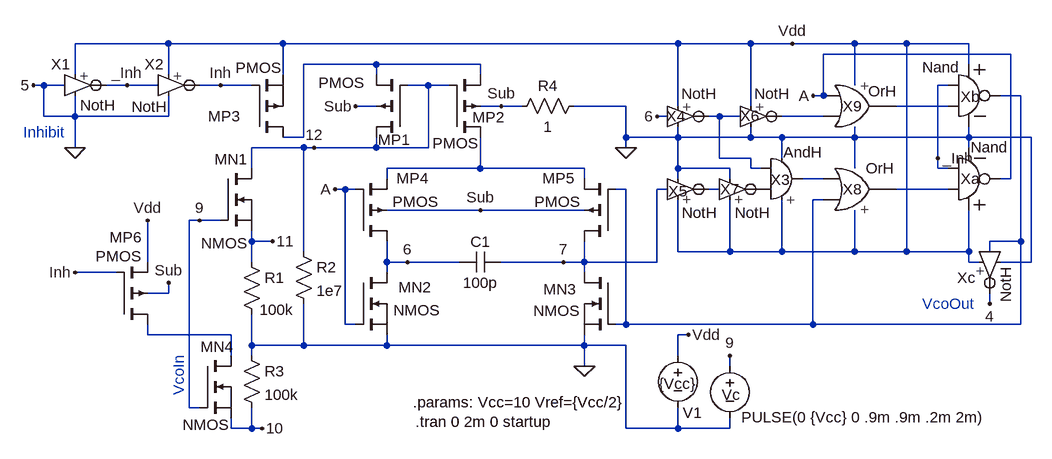
[diagram p0: schematic Ti46Vco.asc]
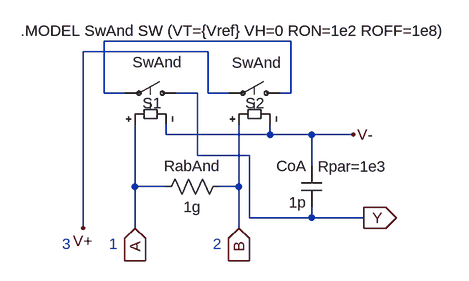
[diagram p1: sub-circuit andh.asc]
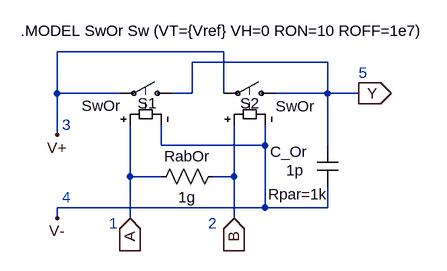
[diagram p2: sub-circuit orh.asc]
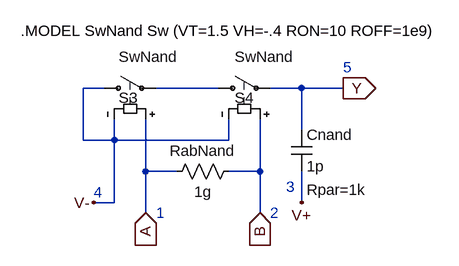
[diagram p3: sub-circuit nand.asc]
Ti46Vco.asc, the LTspice schematic file:
Version 4
SHEET 1 1204 1096
WIRE -384 112 -400 112
WIRE -384 160 -384 112
WIRE -352 112 -384 112
WIRE -336 96 -336 48
WIRE -336 160 -384 160
WIRE -336 160 -336 128
WIRE -336 208 -336 160
WIRE -272 400 -336 400
WIRE -256 112 -288 112
WIRE -224 384 -224 320
WIRE -224 496 -224 480
WIRE -208 112 -256 112
WIRE -192 48 -336 48
WIRE -192 96 -192 48
WIRE -192 160 -336 160
WIRE -192 160 -192 128
WIRE -192 432 -224 432
WIRE -192 432 -192 416
WIRE -160 608 -160 320
WIRE -144 320 -160 320
WIRE -144 608 -160 608
WIRE -112 112 -144 112
WIRE -112 320 -144 320
WIRE -96 496 -224 496
WIRE -96 528 -96 496
WIRE -96 640 -96 624
WIRE -64 112 -112 112
WIRE -64 240 -64 208
WIRE -64 352 -64 336
WIRE -64 384 -64 352
WIRE -64 512 -64 464
WIRE -64 528 -64 512
WIRE -64 640 -96 640
WIRE -64 640 -64 608
WIRE -48 640 -64 640
WIRE -32 352 -64 352
WIRE -16 48 -192 48
WIRE -16 96 -16 48
WIRE 16 192 -16 192
WIRE 16 192 16 80
WIRE 16 208 -64 208
WIRE 16 368 16 208
WIRE 16 512 -64 512
WIRE 16 512 16 448
WIRE 32 208 16 208
WIRE 80 272 64 272
WIRE 80 480 80 272
WIRE 96 272 80 272
WIRE 96 480 80 480
WIRE 128 80 16 80
WIRE 128 96 128 80
WIRE 128 144 96 144
WIRE 128 208 32 208
WIRE 128 208 128 192
WIRE 144 256 144 240
WIRE 144 384 144 352
WIRE 144 400 144 384
WIRE 144 512 16 512
WIRE 144 512 144 496
WIRE 176 384 144 384
WIRE 208 112 176 112
WIRE 208 208 128 208
WIRE 208 208 208 112
WIRE 240 112 208 112
WIRE 256 384 176 384
WIRE 288 80 128 80
WIRE 288 96 288 80
WIRE 288 240 144 240
WIRE 288 240 288 192
WIRE 288 304 144 304
WIRE 320 144 288 144
WIRE 352 144 320 144
WIRE 416 384 320 384
WIRE 448 240 288 240
WIRE 448 256 448 240
WIRE 448 304 288 304
WIRE 448 384 416 384
WIRE 448 384 448 352
WIRE 448 400 448 384
WIRE 448 512 144 512
WIRE 448 512 448 496
WIRE 448 544 448 512
WIRE 512 144 432 144
WIRE 512 192 512 144
WIRE 512 208 512 192
WIRE 512 272 496 272
WIRE 512 480 496 480
WIRE 512 480 512 272
WIRE 512 512 448 512
WIRE 512 640 512 512
WIRE 560 384 448 384
WIRE 560 384 560 272
WIRE 576 160 560 160
WIRE 576 272 560 272
WIRE 592 48 -16 48
WIRE 592 144 592 48
WIRE 592 192 512 192
WIRE 592 192 592 176
WIRE 592 240 592 192
WIRE 592 256 592 240
WIRE 592 368 592 288
WIRE 592 528 592 496
WIRE 592 640 512 640
WIRE 592 640 592 608
WIRE 608 496 592 496
WIRE 656 160 640 160
WIRE 656 224 656 160
WIRE 656 272 640 272
WIRE 672 240 592 240
WIRE 672 256 672 240
WIRE 672 368 592 368
WIRE 672 368 672 288
WIRE 672 544 672 528
WIRE 672 640 592 640
WIRE 672 640 672 624
WIRE 688 160 656 160
WIRE 704 48 592 48
WIRE 704 144 704 48
WIRE 704 192 592 192
WIRE 704 192 704 176
WIRE 704 224 656 224
WIRE 704 240 704 224
WIRE 720 240 704 240
WIRE 752 192 704 192
WIRE 752 224 752 192
WIRE 752 368 672 368
WIRE 752 368 752 288
WIRE 768 48 704 48
WIRE 800 480 512 480
WIRE 800 480 800 288
WIRE 816 128 800 128
WIRE 816 128 816 64
WIRE 816 160 752 160
WIRE 816 256 784 256
WIRE 816 288 800 288
WIRE 864 48 768 48
WIRE 864 112 864 48
WIRE 864 192 752 192
WIRE 864 192 864 176
WIRE 864 240 864 192
WIRE 864 368 752 368
WIRE 864 368 864 304
WIRE 944 48 864 48
WIRE 944 368 864 368
WIRE 944 368 944 48
WIRE 992 224 992 112
WIRE 992 240 992 224
WIRE 1008 112 992 112
WIRE 1008 144 928 144
WIRE 1008 240 992 240
WIRE 1008 272 928 272
WIRE 1040 48 944 48
WIRE 1040 80 1040 48
WIRE 1040 192 864 192
WIRE 1040 192 1040 176
WIRE 1040 208 1040 192
WIRE 1040 368 944 368
WIRE 1040 368 1040 304
WIRE 1040 384 1040 368
WIRE 1056 384 1040 384
WIRE 1072 368 1072 352
WIRE 1072 448 1072 432
WIRE 1104 64 816 64
WIRE 1104 256 1088 256
WIRE 1104 256 1104 64
WIRE 1120 128 1088 128
WIRE 1120 352 1072 352
WIRE 1120 352 1120 128
WIRE 1120 480 800 480
WIRE 1120 480 1120 352
WIRE 1136 192 1040 192
WIRE 1136 384 1088 384
WIRE 1136 384 1136 192
FLAG -256 112 _Inh
FLAG -112 112 Inh
FLAG 32 208 12
FLAG -144 320 9
FLAG 96 144 Sub
FLAG 320 144 Sub
FLAG 288 304 Sub
FLAG 176 384 6
FLAG 416 384 7
FLAG -336 400 Inh
FLAG -224 320 Vdd
FLAG -192 416 Sub
FLAG -400 112 5
FLAG 992 224 _Inh
FLAG 1072 448 4
FLAG -32 352 11
FLAG -336 208 0
FLAG 608 496 Vdd
FLAG 672 528 9
FLAG 768 48 Vdd
FLAG 512 208 0
FLAG 64 272 A
FLAG 800 128 A
FLAG 448 544 0
FLAG 560 160 6
FLAG -48 640 10
SYMBOL nmos -112 240 R0
WINDOW 0 -9 -14 Left 0
WINDOW 3 -30 115 Left 0
SYMATTR InstName MN1
SYMBOL pmos -64 192 M180
WINDOW 0 -67 32 Left 0
WINDOW 3 -25 107 Left 0
SYMATTR InstName MP3
SYMBOL pmos4 176 192 R180
WINDOW 0 -4 -4 Left 0
WINDOW 3 67 84 Left 0
SYMATTR InstName MP1
SYMBOL NotH -352 48 R0
WINDOW 3 24 95 Left 0
SYMATTR InstName X1
SYMBOL NotH -208 48 R0
WINDOW 3 -41 97 Left 0
SYMATTR InstName X2
SYMBOL pmos4 240 192 M180
WINDOW 0 36 31 Left 0
WINDOW 3 -26 -9 Left 0
SYMATTR InstName MP2
SYMBOL res -80 368 R0
WINDOW 3 28 89 Left 0
SYMATTR InstName R1
SYMATTR Value 100k
SYMBOL res 0 352 R0
SYMATTR InstName R2
SYMATTR Value 1e7
SYMBOL pmos4 496 352 R180
WINDOW 0 63 97 Left 0
WINDOW 3 54 61 Left 0
SYMATTR InstName MP5
SYMBOL pmos4 96 352 M180
WINDOW 0 63 97 Left 0
WINDOW 3 57 61 Left 0
SYMATTR InstName MP4
SYMBOL nmos 96 400 R0
WINDOW 0 66 23 Left 0
WINDOW 3 58 58 Left 0
SYMATTR InstName MN2
SYMBOL nmos 496 400 M0
WINDOW 0 60 26 Left 0
WINDOW 3 54 59 Left 0
SYMATTR InstName MN3
SYMBOL cap 320 368 R90
WINDOW 0 0 32 VBottom 0
WINDOW 3 32 32 VTop 0
SYMATTR InstName C1
SYMATTR Value 100p
SYMBOL nmos -144 528 R0
WINDOW 0 1 -14 Left 0
WINDOW 3 -26 106 Left 0
SYMATTR InstName MN4
SYMBOL res -80 512 R0
SYMATTR InstName R3
SYMATTR Value 100k
SYMBOL pmos4 -272 480 M180
WINDOW 0 -11 134 Left 0
WINDOW 3 -32 105 Left 0
SYMATTR InstName MP6
SYMBOL NotH 576 96 R0
WINDOW 3 21 29 Left 0
WINDOW 0 -2 64 Left 0
SYMATTR InstName X4
SYMBOL NotH 576 336 M180
WINDOW 3 22 28 Left 0
WINDOW 0 1 61 Left 0
SYMATTR InstName X5
SYMBOL NotH 688 96 R0
WINDOW 3 22 29 Left 0
WINDOW 0 0 63 Left 0
SYMATTR InstName X6
SYMBOL NotH 656 336 M180
WINDOW 3 24 28 Left 0
WINDOW 0 1 64 Left 0
SYMATTR InstName X7
SYMBOL AndH 752 320 M180
WINDOW 3 2 105 Left 0
SYMATTR InstName X3
SYMBOL Orh 864 336 M180
SYMATTR InstName X8
SYMBOL Orh 864 80 R0
WINDOW 3 21 41 Left 0
SYMATTR InstName X9
SYMBOL Nand 1040 320 M180
WINDOW 0 -13 64 Left 0
WINDOW 3 3 113 Left 0
SYMATTR InstName Xa
SYMBOL Nand 1040 64 R0
WINDOW 0 -13 66 Left 0
WINDOW 3 -72 20 Left 0
SYMATTR InstName Xb
SYMBOL NotH 1008 368 M90
WINDOW 3 23 89 Left 0
WINDOW 0 40 42 VLeft 0
SYMATTR InstName Xc
SYMBOL voltage 592 512 R0
WINDOW 123 0 0 Left 0
WINDOW 39 0 0 Left 0
WINDOW 3 -29 59 Left 0
WINDOW 0 8 104 Left 0
SYMATTR Value {Vcc}
SYMATTR InstName V1
SYMBOL voltage 672 528 R0
WINDOW 123 0 0 Left 0
WINDOW 39 0 0 Left 0
WINDOW 3 18 95 Left 0
WINDOW 0 -12 60 Left 0
SYMATTR Value PULSE(0 {Vcc} 0 .9m .9m .2m 2m)
SYMATTR InstName Vc
SYMBOL res 448 128 R90
WINDOW 0 0 56 VBottom 0
WINDOW 3 32 56 VTop 0
SYMATTR InstName R4
SYMATTR Value 1
TEXT 1048 448 Right 0 ;VcoOut
TEXT -416 184 Left 0 ;Inhibit
TEXT -176 528 VRight 0 ;VcoIn
TEXT 188 630 Left 0 !.tran 0 2m 0 startup
TEXT 184 600 Left 0 !.params: Vcc=10 Vref={Vcc/2}

andh.asc, the sub-circuit schematic file:
Version 4
SHEET 1 880 680
WIRE -80 432 -80 160
WIRE -48 224 -48 144
WIRE -16 224 -48 224
WIRE 0 368 0 272
WIRE 0 432 0 368
WIRE 48 288 48 272
WIRE 48 368 0 368
WIRE 96 224 64 224
WIRE 96 320 96 224
WIRE 112 160 -80 160
WIRE 112 224 112 160
WIRE 144 224 112 224
WIRE 160 368 128 368
WIRE 160 368 160 272
WIRE 160 432 160 368
WIRE 176 320 96 320
WIRE 176 416 176 320
WIRE 208 288 48 288
WIRE 208 288 208 272
WIRE 240 144 -48 144
WIRE 240 224 224 224
WIRE 240 224 240 144
WIRE 272 288 208 288
WIRE 272 336 272 288
WIRE 272 416 176 416
WIRE 272 416 272 400
WIRE 336 288 272 288
WIRE 352 416 272 416
FLAG 352 416 Y
IOPIN 352 416 Out
FLAG 0 432 A
IOPIN 0 432 In
FLAG 160 432 B
IOPIN 160 432 In
FLAG 336 288 V-
FLAG -80 432 V+
SYMBOL sw 80 224 M270
WINDOW 0 -15 39 VRight 0
WINDOW 3 48 8 VRight 0
SYMATTR InstName S1
SYMATTR Value SwAnd
SYMBOL sw 240 224 M270
WINDOW 0 -15 41 VRight 0
WINDOW 3 47 15 VRight 0
SYMATTR InstName S2
SYMATTR Value SwAnd
SYMBOL res 32 384 R270
WINDOW 0 32 56 VTop 0
WINDOW 3 0 56 VBottom 0
SYMATTR InstName RabAnd
SYMATTR Value 1g
SYMBOL cap 288 400 R180
WINDOW 0 24 64 Left 0
WINDOW 3 24 8 Left 0
WINDOW 39 -101 63 Left 0
SYMATTR InstName CoA
SYMATTR Value 1p
SYMATTR SpiceLine Rpar=1e3
TEXT -40 456 Left 0 ;1
TEXT 120 456 Left 0 ;2
TEXT -176 128 Left 0 !.MODEL SwAnd SW (VT={Vref} VH=0 RON=1e2 ROFF=1e8)
TEXT -112 456 Left 0 ;3

orh.asc, the sub-circuit schematic file:
Version 4
SHEET 1 880 680
WIRE -112 224 -112 160
WIRE -112 288 -112 224
WIRE -112 416 -112 400
WIRE -16 224 -112 224
WIRE 0 352 0 272
WIRE 0 416 0 352
WIRE 48 304 48 272
WIRE 48 352 0 352
WIRE 96 224 64 224
WIRE 96 224 96 176
WIRE 144 160 -112 160
WIRE 144 224 144 160
WIRE 160 352 128 352
WIRE 160 352 160 272
WIRE 160 416 160 352
WIRE 208 304 48 304
WIRE 208 304 208 272
WIRE 208 400 -112 400
WIRE 208 400 208 304
WIRE 304 176 96 176
WIRE 304 224 224 224
WIRE 304 224 304 176
WIRE 304 304 304 224
WIRE 304 400 208 400
WIRE 304 400 304 368
WIRE 352 224 304 224
FLAG 352 224 Y
IOPIN 352 224 Out
FLAG 0 416 A
IOPIN 0 416 In
FLAG 160 416 B
IOPIN 160 416 In
FLAG -112 416 V-
FLAG -112 288 V+
SYMBOL sw 80 224 M270
WINDOW 0 -15 39 VRight 0
WINDOW 3 -19 94 VRight 0
SYMATTR InstName S1
SYMATTR Value SwOr
SYMBOL sw 240 224 M270
WINDOW 0 -15 41 VRight 0
WINDOW 3 -20 -44 VRight 0
SYMATTR InstName S2
SYMATTR Value SwOr
SYMBOL res 144 336 R90
WINDOW 0 0 56 VBottom 0
WINDOW 3 32 56 VTop 0
SYMATTR InstName RabOr
SYMATTR Value 1g
SYMBOL cap 288 304 R0
WINDOW 0 -72 10 Left 0
WINDOW 3 -48 38 Left 0
WINDOW 39 -75 75 Left 0
SYMATTR InstName C_Or
SYMATTR Value 1p
SYMATTR SpiceLine Rpar=1k
TEXT -32 424 Left 0 ;1
TEXT 120 424 Left 0 ;2
TEXT 352 192 Left 0 ;5
TEXT -168 128 Left 0 !.MODEL SwOr Sw (VT={Vref} VH=0 RON=10 ROFF=1e7)
TEXT -104 272 Left 0 ;3
TEXT -104 384 Left 0 ;4

nand.asc, the sub-circuit schematic file:
Version 4
SHEET 1 896 680
WIRE -80 304 -80 224
WIRE -48 224 -80 224
WIRE -32 304 -80 304
WIRE -32 304 -32 272
WIRE -32 400 -64 400
WIRE -32 400 -32 304
WIRE 16 352 16 272
WIRE 16 416 16 352
WIRE 64 352 16 352
WIRE 128 224 32 224
WIRE 144 304 -32 304
WIRE 144 304 144 272
WIRE 192 352 144 352
WIRE 192 352 192 272
WIRE 192 416 192 352
WIRE 256 224 208 224
WIRE 256 288 256 224
WIRE 256 400 256 352
WIRE 320 224 256 224
FLAG 320 224 Y
IOPIN 320 224 Out
FLAG 16 416 A
IOPIN 16 416 In
FLAG 192 416 B
IOPIN 192 416 In
FLAG -64 400 V-
FLAG 256 400 V+
SYMBOL sw -64 224 R270
WINDOW 0 -15 39 VRight 0
WINDOW 3 48 39 VRight 0
SYMATTR InstName S3
SYMATTR Value SwNand
SYMBOL sw 112 224 R270
WINDOW 0 -15 41 VRight 0
WINDOW 3 48 41 VRight 0
SYMATTR InstName S4
SYMATTR Value SwNand
SYMBOL res 160 336 R90
WINDOW 0 0 56 VBottom 0
WINDOW 3 32 56 VTop 0
SYMATTR InstName RabNand
SYMATTR Value 1g
SYMBOL cap 240 288 R0
WINDOW 39 24 92 Left 0
SYMATTR SpiceLine Rpar=1k
SYMATTR InstName Cnand
SYMATTR Value 1p
TEXT -176 136 Left 0 !.MODEL SwNand Sw (VT=1.5 VH=-.4 RON=10 ROFF=1e9)
TEXT 32 416 Left 0 ;1
TEXT 208 416 Left 0 ;2
TEXT 320 192 Left 0 ;5
TEXT 232 376 Left 0 ;3
TEXT -64 384 Left 0 ;4

The netlist it stands for:
* Ti46Vco.asc
MN1 12 9 11 11 NMOS
MP3 N002 Inh Vdd Vdd PMOS
MP1 12 12 N002 Sub PMOS
XX1 0 Vdd 0 _Inh NotH params: NotH  ; pins in V+ V- _Q
XX2 _Inh Vdd 0 Inh NotH params: NotH  ; pins in V+ V- _Q
MP2 N003 12 N002 Sub PMOS
R1 11 0 100k
R2 12 0 1e7
MP5 7 N004 N003 Sub PMOS
MP4 6 A N003 Sub PMOS
MN2 6 A 0 0 NMOS
MN3 7 N004 0 0 NMOS
C1 7 6 100p
MN4 N001 9 10 10 NMOS
R3 0 10 100k
MP6 N001 Inh Vdd Sub PMOS
XX4 6 Vdd 0 N005 NotH params: NotH  ; pins in V+ V- _Q
XX5 7 Vdd 0 N006 NotH params: NotH  ; pins in V+ V- _Q
XX6 N005 Vdd 0 N007 NotH params: NotH  ; pins in V+ V- _Q
XX7 N006 Vdd 0 P001 NotH params: NotH  ; pins in V+ V- _Q
XX3 P001 N005 N008 0 Vdd andh params: AndH
XX8 N004 N008 Vdd 0 N010 orh params: OrH
XX9 A N007 Vdd 0 N009 orh params: OrH
XXa N010 _Inh Vdd 0 A nand params: Nand
XXb _Inh N009 Vdd 0 N004 nand params: Nand
XXc N004 Vdd 0 4 NotH params: NotH  ; pins in V+ V- _Q
V1 Vdd 0 {Vcc}
Vc 9 0 PULSE(0 {Vcc} 0 .9m .9m .2m 2m)
R4 0 Sub 1

* block symbol definitions
.subckt andh A B Y V- V+
S1 Y N001 A V- SwAnd
S2 N001 V+ B V- SwAnd
RabAnd A B 1g
CoA Y V- 1p Rpar=1e3
* 1
* 2
.MODEL SwAnd SW (VT={Vref} VH=0 RON=1e2 ROFF=1e8)
* 3
.ends andh

.subckt orh A B V+ V- Y
S1 Y V+ A V- SwOr
S2 Y V+ B V- SwOr
RabOr B A 1g
C_Or Y V- 1p Rpar=1k
* 1
* 2
* 5
.MODEL SwOr Sw (VT={Vref} VH=0 RON=10 ROFF=1e7)
* 3
* 4
.ends orh

.subckt nand A B V+ V- Y
S3 V- N001 A V- SwNand
S4 N001 Y B V- SwNand
RabNand B A 1g
Cnand Y V+ 1p Rpar=1k
.MODEL SwNand Sw (VT=1.5 VH=-.4 RON=10 ROFF=1e9)
* 1
* 2
* 5
* 3
* 4
.ends nand

.model NMOS NMOS
.model PMOS PMOS
.lib standard.mos
* VcoOut
* Inhibit
* VcoIn
.tran 0 2m 0 startup
.params: Vcc=10 Vref={Vcc/2}
.backanno
.end